# Altium schematic sheet analog_part.SchDoc
size A3
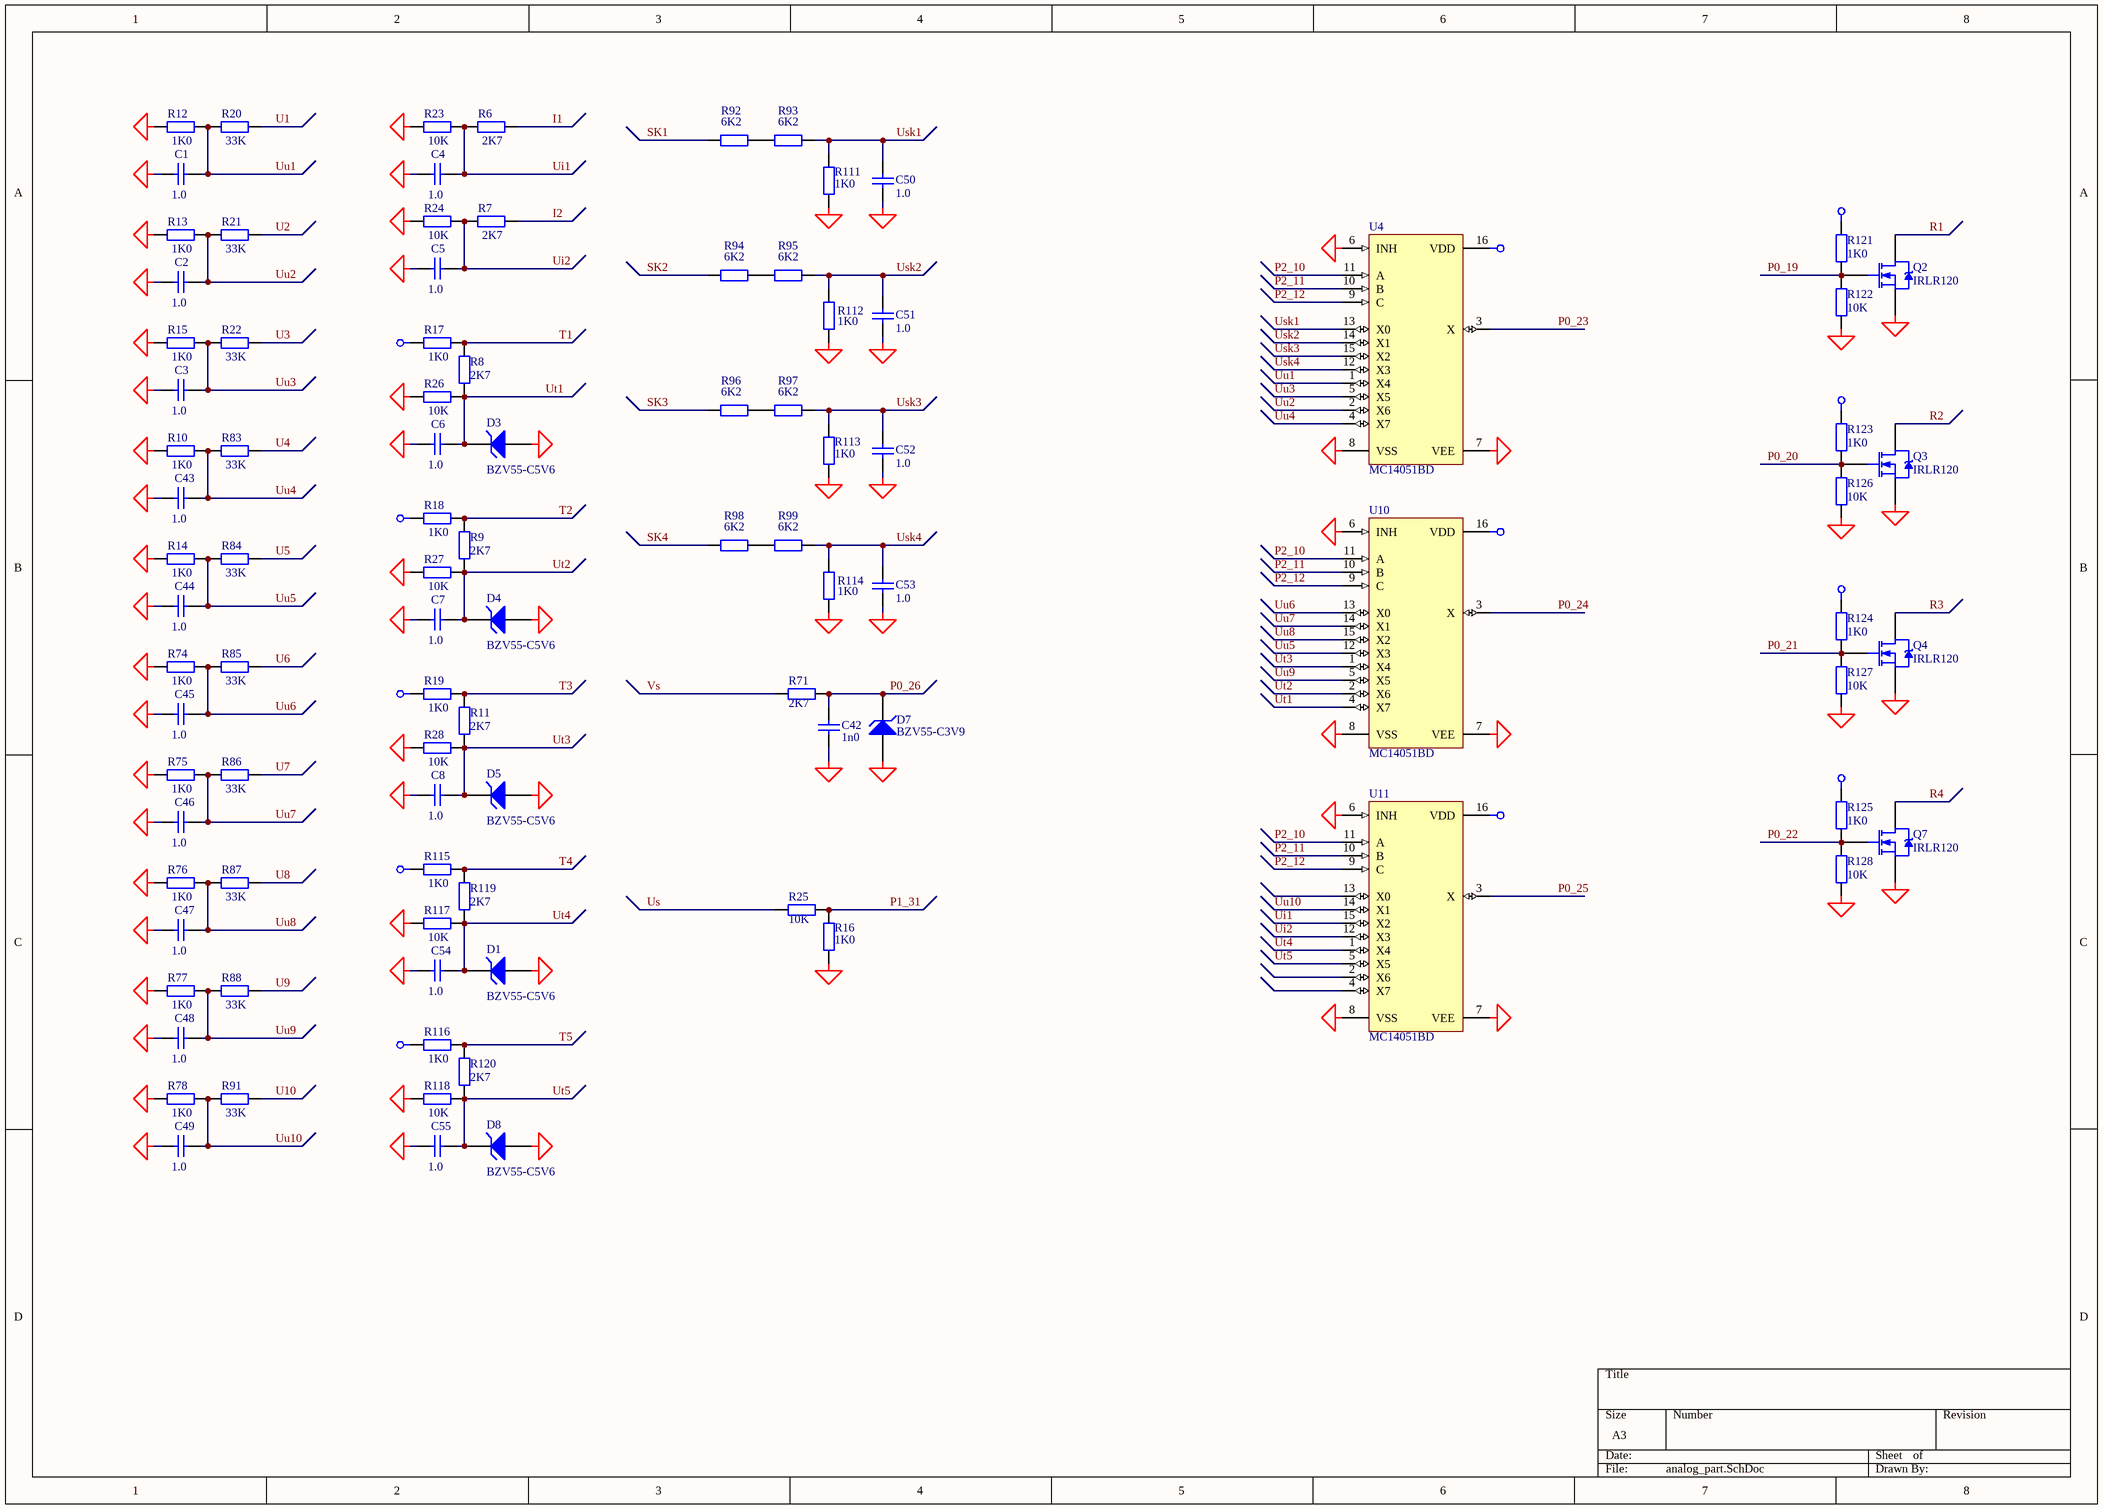
[diagram p0: analog_part.SchDoc]

## Parts
C1  1.0  [C3216-1206]
C2  1.0  [C3216-1206]
C3  1.0  [C3216-1206]
C4  1.0  [C3216-1206]
C5  1.0  [C3216-1206]
C6  1.0  [C3216-1206]
C7  1.0  [C3216-1206]
C8  1.0  [_1206]
C42  1n0  [_1206]
C43  1.0  [C3216-1206]
C44  1.0  [C3216-1206]
C45  1.0  [C3216-1206]
C46  1.0  [C3216-1206]
C47  1.0  [C3216-1206]
C48  1.0  [C3216-1206]
C49  1.0  [C3216-1206]
C50  1.0  [C3216-1206]
C51  1.0  [C3216-1206]
C52  1.0  [C3216-1206]
C53  1.0  [C3216-1206]
C54  1.0  [_1206]
C55  1.0  [_1206]
D1  BZV55-C5V6  [_1206d]
D3  BZV55-C5V6  [_1206d]
D4  BZV55-C5V6  [_1206d]
D5  BZV55-C5V6  [_1206d]
D7  BZV55-C3V9  [_1206d]
D8  BZV55-C5V6  [_1206d]
Q2  IRLR120  [SIP-G3/E8]
Q3  IRLR120  [SIP-G3/E8]
Q4  IRLR120  [SIP-G3/E8]
Q7  IRLR120  [SIP-G3/E8]
R6  2K7  [_1206]
R7  2K7  [_1206]
R8  2K7  [_1206]
R9  2K7  [_1206]
R10  1K0  [_1206]
R11  2K7  [_1206]
R12  1K0  [_1206]
R13  1K0  [_1206]
R14  1K0  [_1206]
R15  1K0  [_1206]
R16  1K0  [_1206]
R17  1K0  [_1206]
R18  1K0  [_1206]
R19  1K0  [_1206]
R20  33K  [_1206]
R21  33K  [_1206]
R22  33K  [_1206]
R23  10K  [_1206]
R24  10K  [_1206]
R25  10K  [_1206]
R26  10K  [_1206]
R27  10K  [_1206]
R28  10K  [_1206]
R71  2K7  [_1206]
R74  1K0  [_1206]
R75  1K0  [_1206]
R76  1K0  [_1206]
R77  1K0  [_1206]
R78  1K0  [_1206]
R83  33K  [_1206]
R84  33K  [_1206]
R85  33K  [_1206]
R86  33K  [_1206]
R87  33K  [_1206]
R88  33K  [_1206]
R91  33K  [_1206]
R92  6K2  [_1206]
R93  6K2  [_1206]
R94  6K2  [_1206]
R95  6K2  [_1206]
R96  6K2  [_1206]
R97  6K2  [_1206]
R98  6K2  [_1206]
R99  6K2  [_1206]
R111  1K0  [_1206]
R112  1K0  [_1206]
R113  1K0  [_1206]
R114  1K0  [_1206]
R115  1K0  [_1206]
R116  1K0  [_1206]
R117  10K  [_1206]
R118  10K  [_1206]
R119  2K7  [_1206]
R120  2K7  [_1206]
R121  1K0  [_1206]
R122  10K  [_1206]
R123  1K0  [_1206]
R124  1K0  [_1206]
R125  1K0  [_1206]
R126  10K  [_1206]
R127  10K  [_1206]
R128  10K  [_1206]
U4  MC14051BD  [SO-G16/C5.85]
U10  MC14051BD  [SO-G16/C5.85]
U11  MC14051BD  [SO-G16/C5.85]

## Nets
+3v3: U4.16(VDD) U10.16(VDD) U11.16(VDD)
+5v: R17.2 R18.2 R19.2 R115.2 R116.2 R121.2 R123.2 R124.2 R125.2
GND: C1.2 C2.2 C3.2 C4.2 C5.2 C6.2 C7.2 C8.2 C42.2 C43.2 C44.2 C45.2 C46.2 C47.2 C48.2 C49.2 C50.2 C51.2 C52.2 C53.2 C54.2 C55.2 D1.1(A) D3.1(A) D4.1(A) D5.1(A) D7.1(A) D8.1(A) Q2.3(S) Q3.3(S) Q4.3(S) Q7.3(S) R10.2 R12.2 R13.2 R14.2 R15.2 R16.2 R23.1 R24.1 R26.1 R27.1 R28.1 R74.2 R75.2 R76.2 R77.2 R78.2 R111.1 R112.1 R113.1 R114.1 R117.1 R118.1 R122.2 R126.2 R127.2 R128.2 U4.6(INH) U4.7(VEE) U4.8(VSS) U10.6(INH) U10.7(VEE) U10.8(VSS) U11.6(INH) U11.7(VEE) U11.8(VSS)
I1: R6.2
I2: R7.2
P0_19: Q2.1(G) R121.1 R122.1
P0_20: Q3.1(G) R123.1 R126.1
P0_21: Q4.1(G) R124.1 R127.1
P0_22: Q7.1(G) R125.1 R128.1
P0_23: U4.3(X)
P0_24: U10.3(X)
P0_25: U11.3(X)
P0_26: C42.1 D7.2(K) R71.1
P1_31: R16.1 R25.1
P2_10: U4.11(A) U10.11(A) U11.11(A)
P2_11: U4.10(B) U10.10(B) U11.10(B)
P2_12: U4.9(C) U10.9(C) U11.9(C)
R1: Q2.4(D)
R2: Q3.4(D)
R3: Q4.4(D)
R4: Q7.4(D)
SK1: R92.1
SK2: R94.1
SK3: R96.1
SK4: R98.1
T1: R8.2 R17.1
T2: R9.2 R18.1
T3: R11.2 R19.1
T4: R115.1 R119.2
T5: R116.1 R120.2
U1: R20.2
U2: R21.2
U3: R22.2
U4: R83.2
U5: R84.2
U6: R85.2
U7: R86.2
U8: R87.2
U9: R88.2
U10: R91.2
Ui1: C4.1 R6.1 R23.2 U11.15(X2)
Ui2: C5.1 R7.1 R24.2 U11.12(X3)
Us: R25.2
Usk1: C50.1 R93.2 R111.2 U4.13(X0)
Usk2: C51.1 R95.2 R112.2 U4.14(X1)
Usk3: C52.1 R97.2 R113.2 U4.15(X2)
Usk4: C53.1 R99.2 R114.2 U4.12(X3)
Ut1: C6.1 D3.2(K) R8.1 R26.2 U10.4(X7)
Ut2: C7.1 D4.2(K) R9.1 R27.2 U10.2(X6)
Ut3: C8.1 D5.2(K) R11.1 R28.2 U10.1(X4)
Ut4: C54.1 D1.2(K) R117.2 R119.1 U11.1(X4)
Ut5: C55.1 D8.2(K) R118.2 R120.1 U11.5(X5)
Uu1: C1.1 R12.1 R20.1 U4.1(X4)
Uu2: C2.1 R13.1 R21.1 U4.2(X6)
Uu3: C3.1 R15.1 R22.1 U4.5(X5)
Uu4: C43.1 R10.1 R83.1 U4.4(X7)
Uu5: C44.1 R14.1 R84.1 U10.12(X3)
Uu6: C45.1 R74.1 R85.1 U10.13(X0)
Uu7: C46.1 R75.1 R86.1 U10.14(X1)
Uu8: C47.1 R76.1 R87.1 U10.15(X2)
Uu9: C48.1 R77.1 R88.1 U10.5(X5)
Uu10: C49.1 R78.1 R91.1 U11.14(X1)
Vs: R71.2
NetR92_2: R92.2 R93.1
NetR94_2: R94.2 R95.1
NetR96_2: R96.2 R97.1
NetR98_2: R98.2 R99.1

Not connected (* = marked no-connect by the designer): U11 2(X6) 4(X7) 13(X0)

## Library data of the parts
C1-C8 C42-C55 = Cap Semi: Capacitor (Semiconductor SIM Model); Manufacturer: Generic Components; Class I: Passive; Value: 1,0; Published: 8-Jun-2000; Revision: July-2002: Re-released for DXP Platform.; Publisher: Altium Limited; Class II: Capacitor
D1 D3-D5 D7 D8 = D Zener: Zener Diode; Manufacturer: Generic Components; Class I: Discrete; Class II: Diode - Zener; Published: 8-Jun-2000; Revision: July-2002: Re-released for DXP Platform.; Publisher: Altium Limited
Q2-Q4 Q7 = IRFR120: HEXFET N-Channel Power MOSFET; Manufacturer: International Rectifier; Revision 1: 10-July-2000: SIM Model Added.; Revision 2: July-2002: Re-released for DXP Platform.; Class I: Discrete; Class II: MOSFET - Power; Note: Pin 2 is trimmed and is electrically connected to Drain.; Published: 8-Jun-2000; Datasheet: Latest Revision: PD-9.523D; Package Reference: TO-252AA; Publisher: Altium Limited
R6-R9 R11 R20-R28 R71 R83-R88 R91-R99 R111-R114 R117-R120 = Res2: Resistor; Manufacturer: Generic Components; Class I: Passive; Rule: Undefined; Published: 8-Jun-2000; Revision: July-2002: Re-released for DXP Platform.; Publisher: Altium Limited; Class II: Resistor
  R6-R9 R11 R71 R119 R120: Value: 2K7
  R20-R22 R83-R88 R91: Value: 33K
  R23-R28 R117 R118: Value: 10K
  R92-R99: Value: 6K2
  R111-R114: Value: 1K0
R10 R12-R19 R74-R78 R115 R116 = Res2: Resistor; Manufacturer: Generic Components; Class I: Passive; Value: 1K; Rule: Undefined; Published: 8-Jun-2000; Revision: July-2002: Re-released for DXP Platform.; Publisher: Altium Limited; Class II: Resistor
R121-R128 = Res2: Resistor; Manufacturer: Generic Components; Class I: Passive; Value: 1K; Published: 8-Jun-2000; Revision: July-2002: Re-released for DXP Platform.; Publisher: Altium Limited; Class II: Resistor
U4 U10 U11 = MC14051BD: 8-Channel Analog Multiplexer/Demultiplexer; Manufacturer: ON Semiconductor; Class I: Logic; Class II: Multiplexer/Encoder/Selector; Published: 15-Apr-2002; Package Reference: 751B-05; Publisher: Altium Limited